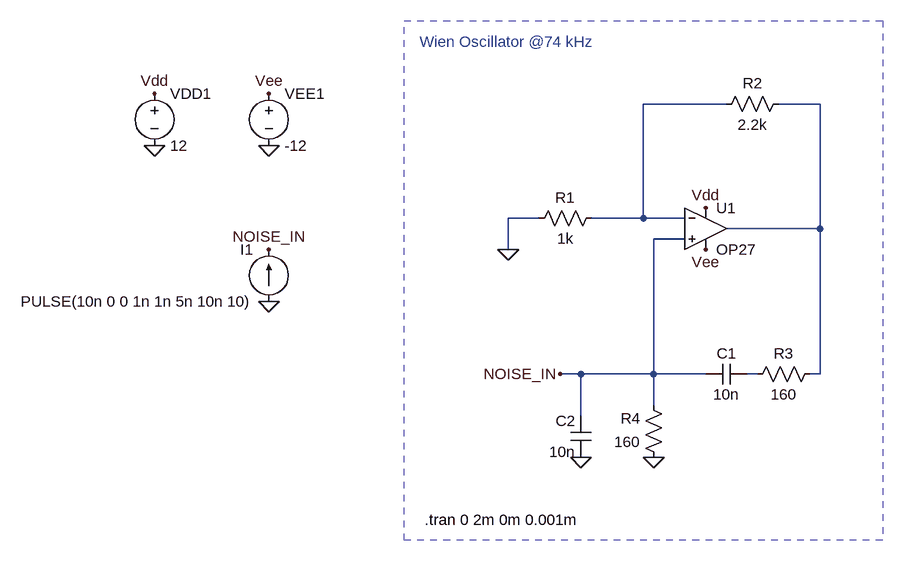
[diagram p0: schematic Draft2.asc]
Draft2.asc, the LTspice schematic file:
Version 4
SHEET 1 880 680
WIRE -96 -112 -224 -112
WIRE 48 -112 -16 -112
WIRE -384 64 -432 64
WIRE -224 64 -224 -112
WIRE -224 64 -304 64
WIRE -160 64 -224 64
WIRE 48 80 48 -112
WIRE 48 80 -96 80
WIRE -160 96 -208 96
WIRE -432 112 -432 64
WIRE -320 304 -352 304
WIRE -208 304 -208 96
WIRE -208 304 -320 304
WIRE -128 304 -208 304
WIRE -48 304 -64 304
WIRE 48 304 48 80
WIRE 48 304 32 304
WIRE -208 352 -208 304
WIRE -320 368 -320 304
FLAG -976 -48 0
FLAG -800 -48 0
FLAG -976 -128 Vdd
FLAG -800 -128 Vee
FLAG -432 112 0
FLAG -208 432 0
FLAG -320 432 0
FLAG -800 192 0
FLAG -128 48 Vdd
FLAG -128 112 Vee
FLAG -800 112 NOISE_IN
FLAG -352 304 NOISE_IN
SYMBOL voltage -976 -144 R0
SYMATTR InstName VDD1
SYMATTR Value 12
SYMBOL voltage -800 -144 R0
SYMATTR InstName VEE1
SYMATTR Value -12
SYMBOL res -288 48 R90
WINDOW 0 0 56 VBottom 2
WINDOW 3 32 56 VTop 2
SYMATTR InstName R1
SYMATTR Value 1k
SYMBOL Opamps\\OP27 -128 16 R0
SYMATTR InstName U1
SYMBOL res 0 -128 R90
WINDOW 0 0 56 VBottom 2
WINDOW 3 32 56 VTop 2
SYMATTR InstName R2
SYMATTR Value 2.2k
SYMBOL res -64 320 R270
WINDOW 0 32 56 VTop 2
WINDOW 3 0 56 VBottom 2
SYMATTR InstName R3
SYMATTR Value 160
SYMBOL res -192 448 R180
WINDOW 0 36 76 Left 2
WINDOW 3 36 40 Left 2
SYMATTR InstName R4
SYMATTR Value 160
SYMBOL cap -64 288 R90
WINDOW 0 0 32 VBottom 2
WINDOW 3 32 32 VTop 2
SYMATTR InstName C1
SYMATTR Value 10n
SYMBOL cap -304 432 R180
WINDOW 0 24 56 Left 2
WINDOW 3 24 8 Left 2
SYMATTR InstName C2
SYMATTR Value 10n
SYMBOL current -800 192 R180
WINDOW 0 24 80 Left 2
WINDOW 3 24 0 Left 2
WINDOW 123 0 0 Left 0
WINDOW 39 0 0 Left 0
SYMATTR InstName I1
SYMATTR Value PULSE(10n 0 0 1n 1n 5n 10n 10)
TEXT -560 528 Left 2 !.tran 0 2m 0m 0.001m
TEXT -568 -208 Left 2 ;Wien Oscillator @74 kHz
RECTANGLE Normal 144 560 -592 -240 2

The netlist it stands for:
* Draft2.asc
VDD1 Vdd 0 12
VEE1 Vee 0 -12
R1 N001 0 1k
XU1 NOISE_IN N001 Vdd Vee N002 OP27  ; pins In+ In- V+ V- OUT
R2 N002 N001 2.2k
R3 N003 N002 160
R4 0 NOISE_IN 160
C1 N003 NOISE_IN 10n
C2 0 NOISE_IN 10n
I1 0 NOISE_IN PULSE(10n 0 0 1n 1n 5n 10n 10)
.tran 0 2m 0m 0.001m
* Wien Oscillator @74 kHz
.lib ADI.lib
.backanno
.end